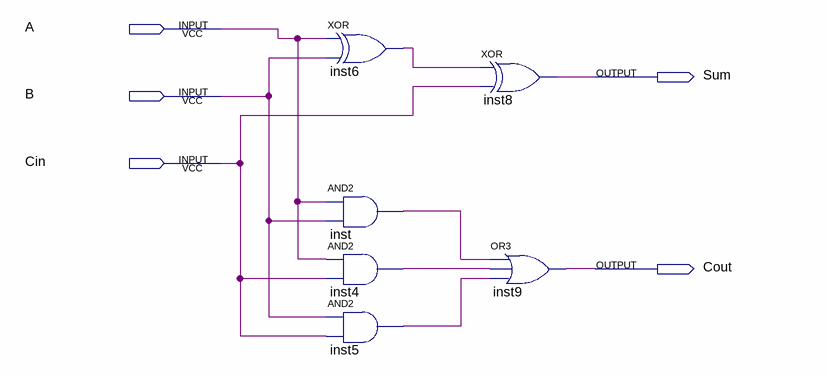
[diagram p0: schematic sheet]
// Quartus schematic full_adder.bdf as structural Verilog: 6 symbols, 5 pins
module full_adder (
  input  A,
  input  B,
  input  Cin,
  output Sum,
  output Cout
);

  wire inst4_out, inst5_out, inst6_out, inst_out;

  xor inst6 (inst6_out, A, B);
  and inst (inst_out, A, B);
  and inst4 (inst4_out, A, Cin);
  and inst5 (inst5_out, B, Cin);
  xor inst8 (Sum, inst6_out, Cin);
  or inst9 (Cout, inst_out, inst4_out, inst5_out);
endmodule
